# EAGLE design pump-board-1.0 (EAGLE 9.4.2)
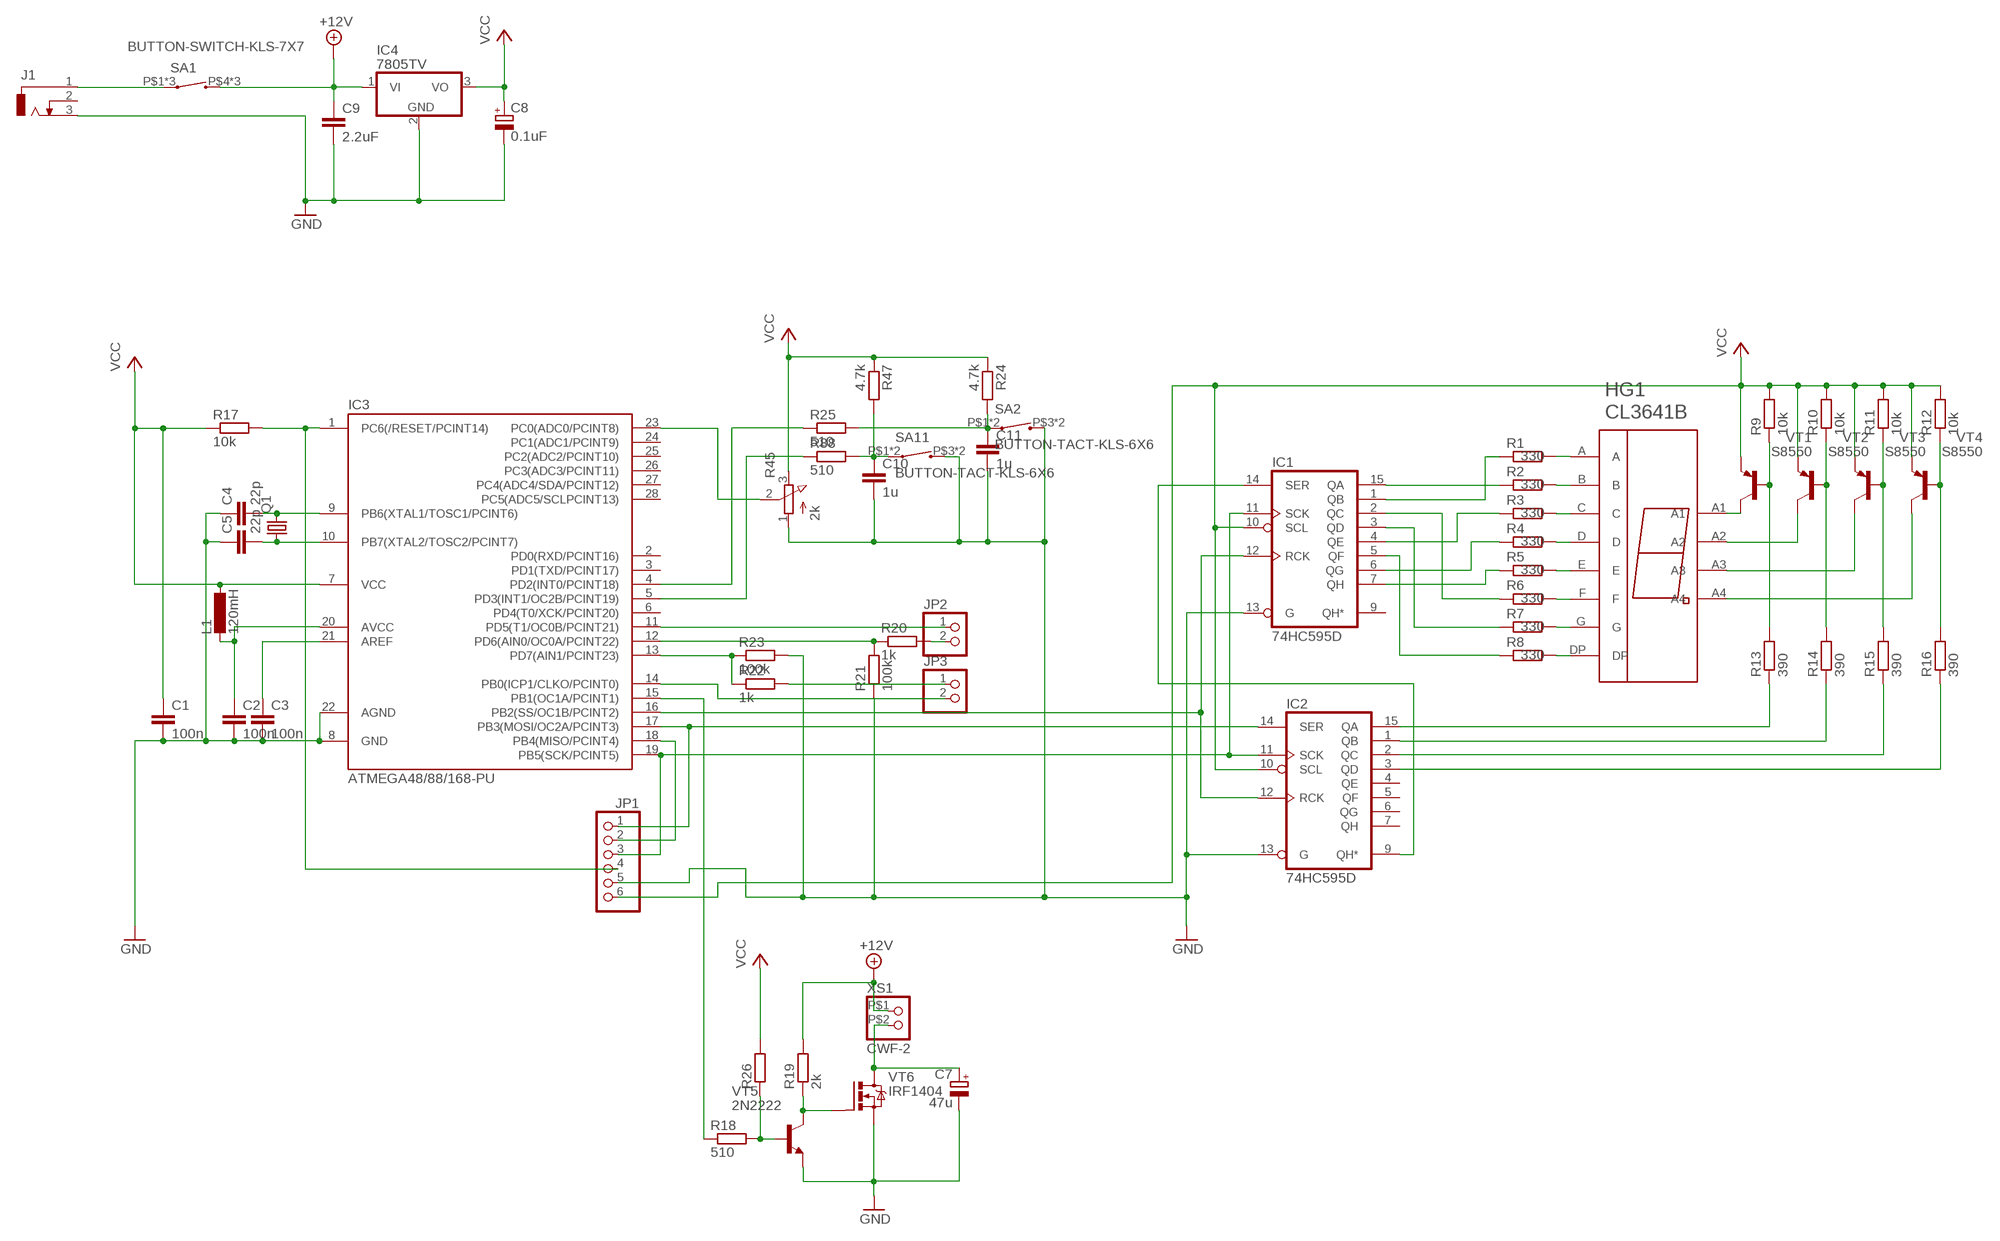
[diagram p0: schematic, sheet 1]

## Parts
C1  100n  C-EU025-025X050  [C025-025X050]
C2  100n  C-EUC1206  [C1206]
C3  100n  C-EUC1206  [C1206]
C4  22p  C-EUC1206  [C1206]
C5  22p  C-EUC1206  [C1206]
C7  47u  CPOL-EUE2.5-5  [E2,5-5]
C8  0.1uF  CPOL-EUE2.5-5  [E2,5-5]
C9  2.2uF  C-EU025-025X050  [C025-025X050]
C10  1u  C-EUC1206  [C1206]
C11  1u  C-EUC1206  [C1206]
HG1  CL3641B  [CL3641B]
IC1  74HC595D  [SO16]
IC2  74HC595D  [SO16]
IC3  ATMEGA48/88/168-PU  [DIL28-3]
IC4  7805TV  [TO220V]
J1  DCJ0303  [DCJ0303]
JP1  PINHD-1X6  [1X06]
JP2  PINHD-1X2  [1X02]
JP3  PINHD-1X2  [1X02]
L1  120mH  L-EU0207/10  [0207/10]
Q1  CRYSTALHC49S  [HC49/S]
R1  330  R-EU_R1206  [R1206]
R2  330  R-EU_R1206  [R1206]
R3  330  R-EU_R1206  [R1206]
R4  330  R-EU_R1206  [R1206]
R5  330  R-EU_R1206  [R1206]
R6  330  R-EU_R1206  [R1206]
R7  330  R-EU_R1206  [R1206]
R8  330  R-EU_R1206  [R1206]
R9  10k  R-EU_R1206  [R1206]
R10  10k  R-EU_R1206  [R1206]
R11  10k  R-EU_R1206  [R1206]
R12  10k  R-EU_R1206  [R1206]
R13  390  R-EU_R1206  [R1206]
R14  390  R-EU_R1206  [R1206]
R15  390  R-EU_R1206  [R1206]
R16  390  R-EU_R1206  [R1206]
R17  10k  R-EU_0207/10  [0207/10]
R18  510  R-EU_0207/10  [0207/10]
R19  2k  R-EU_R1206  [R1206]
R20  1k  R-EU_R1206  [R1206]
R21  100k  R-EU_R1206  [R1206]
R22  1k  R-EU_R1206  [R1206]
R23  100k  R-EU_R1206  [R1206]
R24  4.7k  R-EU_R1206  [R1206]
R25  510  R-EU_R1206  [R1206]
R26  R-EU_R1206  [R1206]
R45  2k  3RP/1610N  [3RP/1610N]
R47  4.7k  R-EU_R1206  [R1206]
R88  510  R-EU_R1206  [R1206]
SA1  BUTTON-SWITCH-KLS-7X7  [KSL7-7X7]
SA2  BUTTON-TACT-KLS-6X6  [KLS7-6X6]
SA11  BUTTON-TACT-KLS-6X6  [KLS7-6X6]
VT1  S8550  [TO92]
VT2  S8550  [TO92]
VT3  S8550  [TO92]
VT4  S8550  [TO92]
VT5  2N2222  [TO92]
VT6  IRF1404  [TO220-V]
XS1  CWF-2  [CWF-2]

## Nets
+12V: C9.1 IC4.1(VI) R19.2 SA1.P$4 SA1.P$5 SA1.P$6 XS1.P$1
ADC1: IC3.23(PC0(ADC0/PCINT8)) R45.2(S)
GND: C1.2 C2.2 C3.2 C4.1 C5.1 C7.- C8.- C9.2 C10.2 C11.2 IC1.13(G) IC2.13(G) IC3.8(GND) IC3.22(AGND) IC4.2(GND) J1.3 JP1.5 R21.1 R23.2 R45.1(A) SA2.P$3 SA2.P$4 SA11.P$3 SA11.P$4 VT5.3(E) VT6.S
MODE-CTRL-B: IC3.5(PD3(INT1/OC2B/PCINT19)) R88.1
N$1: HG1.A1 VT1.1(C)
N$2: HG1.A2 VT2.1(C)
N$3: HG1.A3 VT3.1(C)
N$4: HG1.A4 VT4.1(C)
N$5: R9.1 R13.2 VT1.2(B)
N$6: R10.1 R14.2 VT2.2(B)
N$7: R11.1 R15.2 VT3.2(B)
N$8: R12.1 R16.2 VT4.2(B)
N$9: HG1.DP R8.2
N$10: HG1.G R7.2
N$11: HG1.F R6.2
N$12: IC2.15(QA) R13.1
N$13: HG1.E R5.2
N$14: HG1.D R4.2
N$15: HG1.C R3.2
N$16: HG1.B R2.2
N$17: HG1.A R1.2
N$18: IC2.1(QB) R14.1
N$19: IC2.2(QC) R15.1
N$20: IC2.3(QD) R16.1
N$21: IC1.15(QA) R2.1
N$22: IC1.1(QB) R1.1
N$23: IC1.2(QC) R6.1
N$24: IC1.4(QE) R3.1
N$25: IC1.7(QH) R5.1
N$26: IC1.5(QF) R8.1
N$27: IC1.3(QD) R7.1
N$28: IC1.6(QG) R4.1
N$29: IC1.14(SER) IC2.9(QH*)
N$30: IC3.18(PB4(MISO/PCINT4)) JP1.2
N$31: IC1.12(RCK) IC2.12(RCK) IC3.16(PB2(SS/OC1B/PCINT2))
N$32: C3.1 IC3.21(AREF)
N$33: IC1.11(SCK) IC2.11(SCK) IC3.19(PB5(SCK/PCINT5)) JP1.3
N$35: IC3.1(PC6(/RESET/PCINT14)) JP1.4 R17.2
N$36: C2.1 IC3.20(AVCC) L1.2
N$37: C5.2 IC3.10(PB7(XTAL2/TOSC2/PCINT7)) Q1.1
N$38: C4.2 IC3.9(PB6(XTAL1/TOSC1/PCINT6)) Q1.2
N$39: R19.1 VT5.1(C) VT6.G
N$40: R18.2 R26.1 VT5.2(B)
N$41: C7.+ VT6.D XS1.P$2
N$42: IC3.15(PB1(OC1A/PCINT1)) R18.1
N$43: IC3.12(PD6(AIN0/OC0A/PCINT22)) R20.1 R21.2
N$44: IC3.11(PD5(T1/OC0B/PCINT21)) JP2.1
N$45: IC3.14(PB0(ICP1/CLKO/PCINT0)) JP3.2
N$46: IC3.13(PD7(AIN1/PCINT23)) R22.1 R23.1
N$47: JP3.1 R22.2
N$48: JP2.2 R20.2
N$49: C10.1 R47.2 R88.2 SA11.P$1 SA11.P$2
N$50: IC3.4(PD2(INT0/PCINT18)) R25.1
N$51: C11.1 R24.2 R25.2 SA2.P$1 SA2.P$2
N$52: IC2.14(SER) IC3.17(PB3(MOSI/OC2A/PCINT3)) JP1.1
N$62: J1.1 SA1.P$1 SA1.P$2 SA1.P$3
VCC: C1.1 C8.+ IC1.10(SCL) IC2.10(SCL) IC3.7(VCC) IC4.3(VO) JP1.6 L1.1 R9.2 R10.2 R11.2 R12.2 R17.1 R24.1 R26.2 R45.3(E) R47.1 VT1.3(E) VT2.3(E) VT3.3(E) VT4.3(E)
Unconnected: IC1.9(QH*) IC2.4(QE) IC2.5(QF) IC2.6(QG) IC2.7(QH) IC3.2(PD0(RXD/PCINT16)) IC3.3(PD1(TXD/PCINT17)) IC3.6(PD4(T0/XCK/PCINT20)) IC3.24(PC1(ADC1/PCINT9)) IC3.25(PC2(ADC2/PCINT10)) IC3.26(PC3(ADC3/PCINT11)) IC3.27(PC4(ADC4/SDA/PCINT12)) IC3.28(PC5(ADC5/SCLPCINT13)) J1.2

## Power pins joined to a net without a drawn wire
GND: IC1.8(GND) IC2.8(GND)
VCC: IC1.16(VCC) IC2.16(VCC)

## Library data of the parts
C1-C5 C9-C11 = rcl:C-EU: CAPACITOR, European symbol; SPICEPREFIX: C
C7 C8 = rcl:CPOL-EU: POLARIZED CAPACITOR, European symbol; SPICEPREFIX: C
HG1 = dragberry:CL3641B
IC1 IC2 = 74xx-eu:74*595: 8-bit SHIFT REGISTER, output latch
IC3 = atmega8:ATMEGA48/88/168-PU
IC4 = linear:78*: Positive VOLTAGE REGULATOR Source: http://cache.national.com/ds/LM/LM78L05.pdf http://www.fairchildsemi.com/ds/LM/LM7805.pdf
J1 = con-jack:DCJ0303: DC POWER JACK Source: DCJ0303.pdf; OC_FARNELL: unknown; OC_NEWARK: unknown
JP1 = pinhead:PINHD-1X6: PIN HEADER
JP2 JP3 = pinhead:PINHD-1X2: PIN HEADER
L1 = rcl:L-EU: INDUCTOR, European symbol; SPICEPREFIX: L
Q1 = crystal:CRYSTAL: CRYSTAL; OC_FARNELL: 1667008; OC_NEWARK: unknown
R1-R26 R47 R88 = rcl:R-EU_: RESISTOR, European symbol; SPICEPREFIX: R
R45 = pot:3RP/1610N: 16mm Potentiometer one level Source: http://www.alphapotentiometers.net/html/16mm_pot_2.html
SA1 SA2 SA11 = dragberry:BUTTON
VT1-VT4 = dragberry:S8550
VT5 = dragberry:2N2222
VT6 = dragberry:IRF1404
XS1 = dragberry:CWF-2

## Board
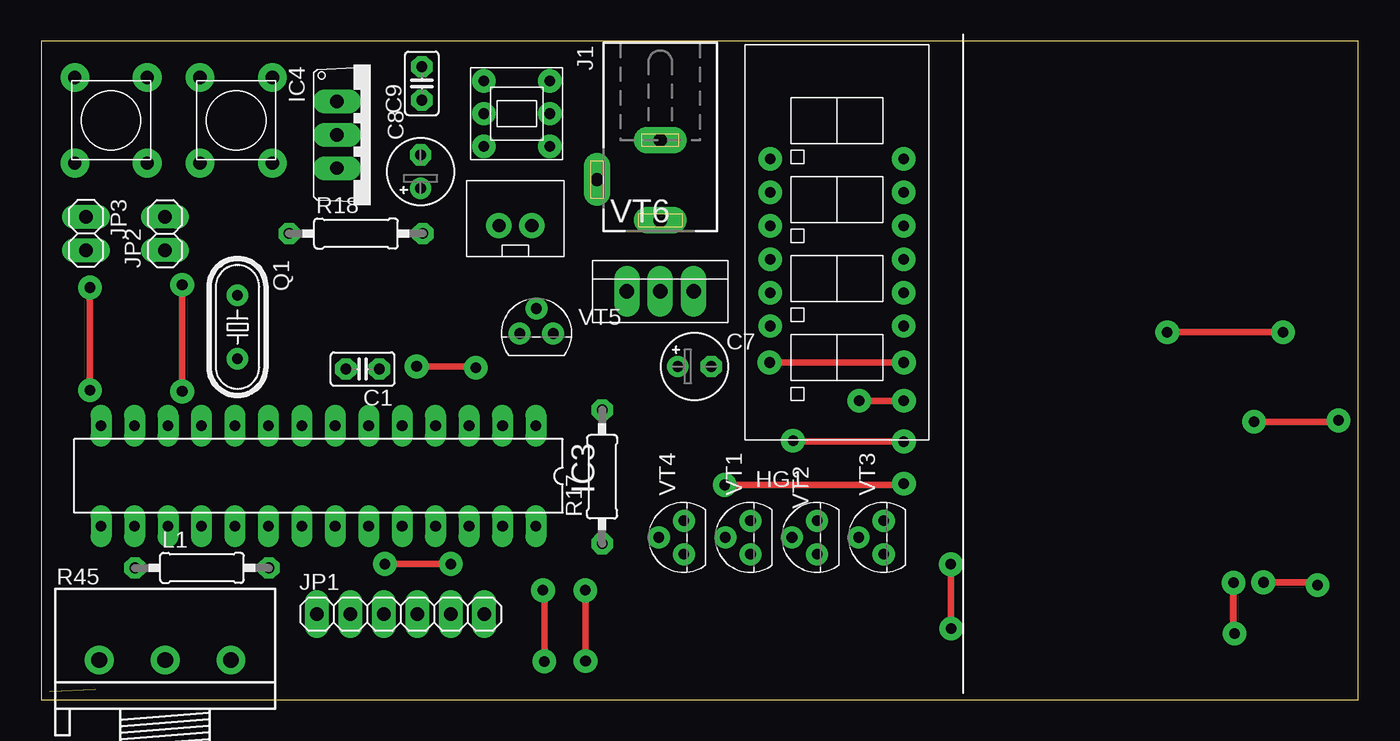
[diagram p1: board, top side]
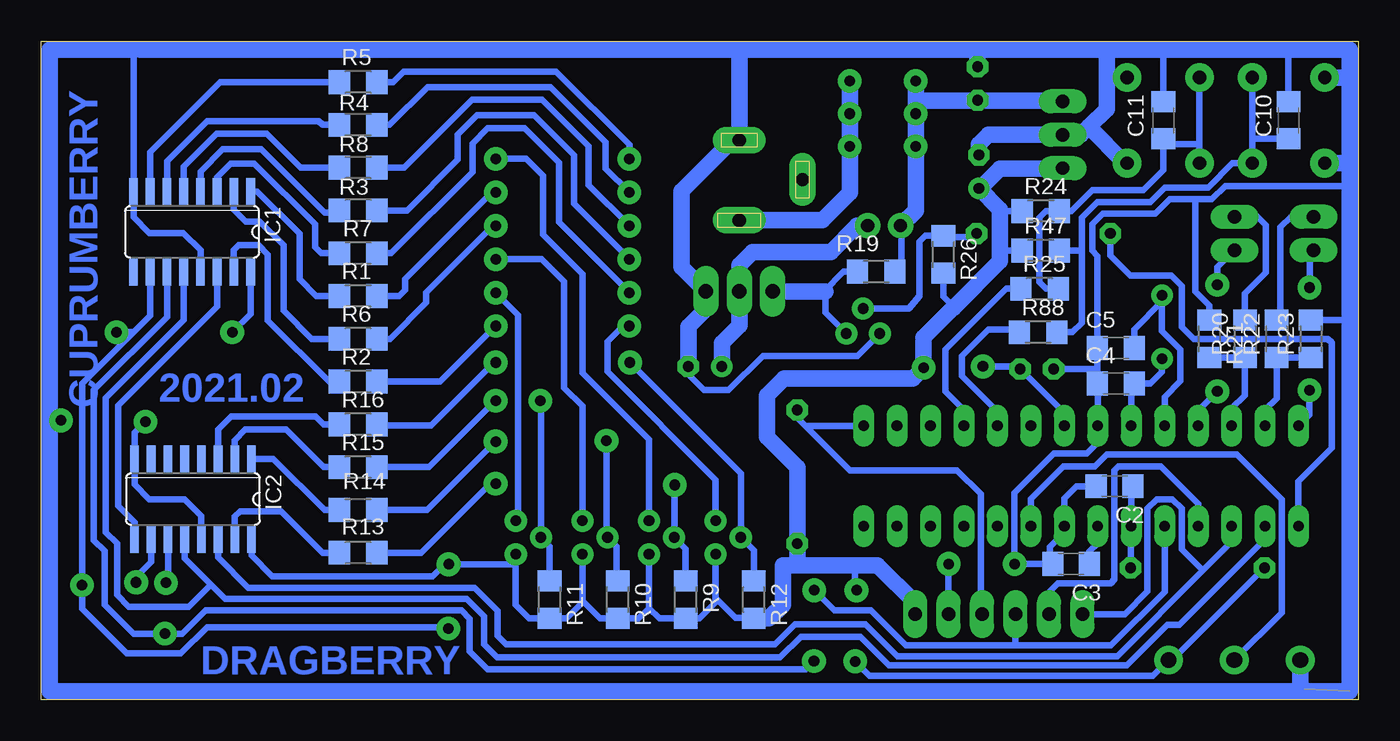
[diagram p2: board, bottom side, seen from below]

Size 100 x 50 mm. Coordinates in mm from the lower left corner, seen from the top.
Outline: 0,0 100,0 100,50 0,50 0,0
Copper layers (1*16): Top 0.035mm / dielectric 1.5mm / Bottom 0.035mm
Design rules "default *": minimum track width 6mil, minimum drill 0.35mm, track to track 6mil, track to pad 6mil, pad to pad 6mil, via to via 6mil, smd to smd 6mil, copper to edge 6mil, drill to drill 6mil, minimum pad ring 0.4mm, minimum via ring 8mil, stop-mask expansion 4mil, vias tented up to drill 0mil, thermal gap 10mil

### Footprints (pad centres in the part's own frame; a part is rotated, then mirrored left to right if it is on the bottom)
C025-025X050 = drill 0.813 octagon: 1 -1.27,0; 2 1.27,0
C1206 = smd 1.6 x 1.8: 1 -1.4,0; 2 1.4,0
E2,5-5 = drill 0.813 pad 1.6: + -1.27,0 | drill 0.813 pad 1.6 octagon: - 1.27,0
CL3641B = drill 0.8 pad 1.778: A -3.81,5.08; A1 -6.35,5.08; A2 1.27,5.08; A3 3.81,5.08; A4 6.35,-5.08; B 6.35,5.08; C 1.27,-5.08; D -3.81,-5.08; DP -1.27,-5.08; E -6.35,-5.08; F -1.27,5.08; G 3.81,-5.08
SO16 = smd 0.66 x 2.032: 1 -4.445,-3.073; 2 -3.175,-3.073; 3 -1.905,-3.073; 4 -0.635,-3.073; 5 0.635,-3.073; 6 1.905,-3.073; 7 3.175,-3.073; 8 4.445,-3.073; 9 4.445,3.073; 10 3.175,3.073; 11 1.905,3.073; 12 0.635,3.073; 13 -0.635,3.073; 14 -1.905,3.073; 15 -3.175,3.073; 16 -4.445,3.073
DIL28-3 = drill 0.813 long: 1 -16.51,-3.81; 2 -13.97,-3.81; 3 -11.43,-3.81; 4 -8.89,-3.81; 5 -6.35,-3.81; 6 -3.81,-3.81; 7 -1.27,-3.81; 8 1.27,-3.81; 9 3.81,-3.81; 10 6.35,-3.81; 11 8.89,-3.81; 12 11.43,-3.81; 13 13.97,-3.81; 14 16.51,-3.81; 15 16.51,3.81; 16 13.97,3.81; 17 11.43,3.81; 18 8.89,3.81; 19 6.35,3.81; 20 3.81,3.81; 21 1.27,3.81; 22 -1.27,3.81; 23 -3.81,3.81; 24 -6.35,3.81; 25 -8.89,3.81; 26 -11.43,3.81; 27 -13.97,3.81; 28 -16.51,3.81
TO220V = drill 1.016 long: 1 -2.54,-2.54; 2 0,-2.54; 3 2.54,-2.54
DCJ0303 = drill 1 pad 2 long: 1 0,3.1; 2 4.8,0; 3 0,-3
1X06 = drill 1.016 long: 1 -6.35,0; 2 -3.81,0; 3 -1.27,0; 4 1.27,0; 5 3.81,0; 6 6.35,0
1X02 = drill 1.016 long: 1 -1.27,0; 2 1.27,0
0207/10 = drill 0.813 octagon: 1 -5.08,0; 2 5.08,0
HC49/S = drill 0.813: 1 -2.413,0; 2 2.413,0
R1206 = smd 1.6 x 1.803: 1 -1.422,0; 2 1.422,0
3RP/1610N = drill 1.2 pad 2.184: 1 -5,0; 2 0,0; 3 5,0
KSL7-7X7 = drill 0.8 pad 1.778: P$1 -2.5,2.5; P$2 0,2.5; P$3 2.5,2.5; P$4 2.5,-2.5; P$5 0,-2.5; P$6 -2.5,-2.5
KLS7-6X6 = drill 1 pad 2.184: P$1 -3.25,2.75; P$2 3.25,2.75; P$3 -3.25,-2.75; P$4 3.25,-2.75
TO92 = drill 0.813 pad 1.676: 1 1.27,0; 2 0,1.905; 3 -1.27,0
TO220-V = drill 1.118 long: D 0,0; G -2.54,0; S 2.54,0
CWF-2 = drill 1 pad 1.93: P$1 -1.25,0; P$2 1.25,0

### Placement (x,y rotation side)
C1  24.4,25.1 180 top
C2  18.5,16.2 180 bottom
C3  21.8,10.3 180 bottom
C4  18.4,24 0 bottom
C5  18.4,26.7 0 bottom
C7  49.6,25.3 0 top
C8  28.8,40.1 90 top
C9  28.9,46.8 90 top
C10  5.3,44 90 bottom
C11  14.8,44 90 bottom
HG1  60.42,34.72 270 top
IC1  88.55,35.52 180 bottom
IC2  88.48,15.22 180 bottom
IC3  21.05,16.98 180 top
IC4  25,42.9 270 top
J1  47,39.5 180 top
JP1  27.29,6.48 0 top
JP2  9.4,35.4 90 top
JP3  3.4,35.4 270 top
L1  12.2,10 0 top
Q1  14.9,28.3 270 top
R1  75.94,30.65 0 bottom
R2  75.94,24.15 0 bottom
R3  75.94,37.15 0 bottom
R4  75.94,43.65 0 bottom
R5  75.94,46.9 0 bottom
R6  75.94,27.4 0 bottom
R7  75.94,33.9 0 bottom
R8  75.94,40.4 0 bottom
R9  51.07,7.58 270 bottom
R10  56.23,7.58 270 bottom
R11  61.4,7.58 270 bottom
R12  45.9,7.58 270 bottom
R13  75.94,11.15 0 bottom
R14  75.94,14.4 0 bottom
R15  75.94,17.65 0 bottom
R16  75.94,20.9 0 bottom
R17  42.59,16.92 90 top
R18  23.9,35.4 0 top
R19  36.6,32.5 0 bottom
R20  8.6,27.4 90 bottom
R21  11.3,27.4 270 bottom
R22  6.2,27.4 90 bottom
R23  3.6,27.4 90 bottom
R24  24.1,37.1 0 bottom
R25  24.2,31.2 0 bottom
R26  31.5,33.8 270 bottom
R45  9.4,3 0 top
R47  24.1,34.1 0 bottom
R88  24.3,27.9 0 bottom
SA1  36.1,44.5 270 top
SA2  14.8,44 90 top
SA11  5.3,44 270 top
VT1  53.85,12.31 90 top
VT2  58.91,12.31 90 top
VT3  63.97,12.31 90 top
VT4  48.79,12.31 90 top
VT5  37.6,27.8 0 top
VT6  47,31 0 top
XS1  36,36 0 top

### Tracks (layer width: path | path; a pad name or v marks a point on that pad's centre or on a via)
+12V
  Bottom 0.508: 34.07,36.68 XS1.P$1 | R19.2 34.68,33 34.68,36.07
  Bottom 1.27: IC4.1 24.1,45.5 28.93,45.5 | C9.1 28.93,45.5 | XS1.P$1 34.68,36.07 33.6,37.15 SA1.P$4 SA1.P$5 SA1.P$6 33.6,45.5 28.93,45.5
ADC1
  Bottom 0.508: R45.2 5.8,6.6 5.8,15.2 9.2,18.6 19.1,18.6 20,17.7 22.4,17.7 24.86,15.24 IC3.23
GND  (via drill 0.8 pad 1.8)  (1 unrouted)
  Top 0.508: v92.1,21.1 98.4,21.1 v98.5,21.2 | v26.1,10.3 v31.1,10.3
  Bottom 0.508: 93,49.37 IC1.8 93,36.65 91.8,35.45 89.22,35.45 87.92,34.15 IC1.13 | IC2.13 87.84,13.95 89.1,15.2 91.8,15.2 92.92,16.32 IC2.8 92.92,20.27 v92.1,21.1 | v98.5,21.2 99.36,21.2 | 19.8,25.1 C5.1 19.8,33.7 20.2,34.1 20.2,36.1 19.4,36.9 15.4,36.9 14.3,38 12.37,38 | 19.8,25.1 C4.1 19.78,23.98 IC3.8 19.78,19.52 20.6,18.7 23.1,18.7 26.1,15.7 v26.1,10.3 C3.2 23.39,10.49 23.39,11.6 22.32,12.67 IC3.22 22.32,15.28 21.4,16.2 C2.2 | 49.54,29.94 VT6.S | C11.2 14.8,49.16 15,49.37 | C10.2 5.3,49.37 | 0.64,39 10.1,39 11.1,38 12.37,38 | VT5.3 38.03,26.1 45.2,26.1 47.8,23.5 49.67,23.5 50.87,24.7 C7.- | C1.2 19.8,25.1 | R21.1 11.3,29.92 12.37,30.99 12.37,38 | R23.2 0.71,28.82 0.64,28.9 | v31.1,10.3 JP1.5
  Bottom 1.27: 0.64,47.25 0.64,49.37 5.3,49.37 15,49.37 19.3,49.37 | 93,49.37 99.36,49.37 99.36,21.2 99.36,0.64 0.64,0.64 0.64,28.9 0.64,39 0.64,40.75 | 92.5,49.37 47.2,49.37 | 47.2,49.37 28.9,49.37 | 28.9,49.37 19.3,49.37 | 47.2,49.37 47,49.16 J1.3 47.5,42.5 51.4,38.6 51.4,32.86 VT6.S 49.54,29.66 50.87,28.33 C7.- | 20.46,43.5 21.06,42.9 IC4.2 28.07,42.9 28.8,42.17 C8.- | 20.46,43.5 19.1,44.86 19.1,47.25 | 19.1,47.25 19.1,49.16 19.3,49.37 | C9.2 28.9,49.37 | 0.64,40.75 SA11.P$4 | SA2.P$4 19.1,47.25 | 20.46,43.5 17.71,40.75 SA2.P$3 | SA11.P$3 0.64,47.25 | 0.64,47.25 0.64,40.75 | R45.1 4.4,0.79 4.1,0.79
MODE-CTRL-B
  Bottom 0.508: IC3.5 27.4,21.89 30.1,24.59 30.1,26.1 28.1,28.1 25.92,28.1 R88.1
N$1
  Bottom 0.508: HG1.A1 63.17,41.07 61.9,39.8 61.9,35.3 58.9,32.3 58.9,24.8 53.85,19.75 VT1.1
N$2
  Bottom 0.508: HG1.A2 62,33.45 60.3,31.75 60.3,23.67 58.91,22.28 VT2.1
N$3
  Bottom 0.508: HG1.A3 63.8,29.21 63.8,13.65 63.87,13.58 VT3.1
N$4
  Bottom 0.508: HG1.A4 55.84,28.37 57,27.21 57,24.9 48.79,16.69 VT4.1
N$5  (via drill 0.8 pad 1.8)
  Top 0.508: v65.5,16.4 65.4,16.3 v51.9,16.3
  Bottom 0.508: R9.1 51.07,11.43 VT1.2 51.9,12.36 v51.9,16.3 | v65.5,16.4 65.9,16.4 71.15,11.15 R13.2
N$6  (via drill 0.8 pad 1.8)
  Top 0.508: v57.08,19.66 57.08,19.6 v65.5,19.6
  Bottom 0.508: R10.1 56.31,9.08 56.31,11.62 VT2.2 57.08,12.38 v57.08,19.66 | R14.2 70.7,14.4 v65.5,19.6
N$7  (via drill 0.8 pad 1.8)
  Top 0.508: v65.5,22.7 v62.11,22.7
  Bottom 0.508: R11.1 61.4,11.64 VT3.2 62.06,22.55 62.11,22.6 v62.11,22.7 | R15.2 70.55,17.65 v65.5,22.7
N$8  (via drill 0.8 pad 1.8)
  Top 0.508: v65.5,25.6 v55.3,25.6
  Bottom 0.508: R12.1 45.9,11.32 VT4.2 46.88,17.18 v55.3,25.6 | v65.5,25.6 65.6,25.6 70.4,20.8 74.42,20.8 R16.2
N$9
  Bottom 0.508: HG1.DP 58.44,39.09 58.44,42.04 61.96,45.56 67.28,45.56 72.44,40.4 R8.2
N$10
  Bottom 0.508: R7.2 73.42,33.9 67.26,40.06 67.26,42.24 66.11,43.39 63.29,43.39 60.7,40.8 60.7,36.27 HG1.G
N$11
  Bottom 0.508: HG1.F 65.71,35.99 70.78,30.92 70.78,30.15 73.53,27.4 R6.2
N$12
  Bottom 0.508: R13.1 78.65,11.15 81.8,14.3 84.9,14.3 85.31,13.89 IC2.15
N$13
  Bottom 0.508: HG1.E 55.34,42.14 60.9,47.7 72.48,47.7 73.28,46.9 R5.2
N$14
  Bottom 0.508: HG1.D 57.14,40.33 57.14,42.34 61.33,46.53 70.68,46.53 73.56,43.65 R4.2
N$15
  Bottom 0.508: HG1.C 59.54,37.65 59.54,41.34 62.6,44.4 66.9,44.4 68.38,42.92 68.38,40.99 72.22,37.15 R3.2
N$16
  Bottom 0.508: R2.2 69.72,24.15 HG1.B
N$17
  Bottom 0.508: HG1.A 65.77,38.53 72.38,31.92 72.38,31.12 72.85,30.65 R1.2
N$18
  Bottom 0.508: R14.1 78.5,14.4 82.39,18.29 IC2.1
N$19
  Bottom 0.508: R15.1 78.56,17.65 81.41,20.5 84.5,20.5 85.31,19.7 IC2.2
N$20
  Bottom 0.508: IC2.3 86.58,20.52 85.6,21.5 79.16,21.5 78.56,20.9 R16.1
N$21
  Bottom 0.508: R2.1 78.15,24.15 82.8,28.8 82.8,33.8 83.5,34.5 85,34.5 85.38,34.12 IC1.15
N$22
  Bottom 0.508: R1.1 79.13,30.65 80.4,31.92 80.4,35.4 83.59,38.59 IC1.1
N$23
  Bottom 0.508: IC1.2 85.38,37.2 84.47,36.3 83.4,36.3 81.6,34.5 81.6,29.53 79.47,27.4 R6.1
N$24
  Bottom 0.508: IC1.4 87.92,40.1 86.22,41.8 83.3,41.8 78.5,37 77.51,37 R3.1
N$25
  Bottom 0.508: R5.1 86.4,46.9 91.72,41.58 IC1.7
N$26
  Bottom 0.508: IC1.5 89.19,40.49 86.68,43 82.9,43 80.3,40.4 R8.1
N$27
  Bottom 0.508: IC1.3 86.64,39.69 85.64,40.7 83.82,40.7 79.22,36.1 79.22,34.36 78.76,33.9 R7.1
N$28
  Bottom 0.508: IC1.6 90.45,40.89 87.42,43.93 78.92,43.93 78.64,43.65 R4.1
N$29
  Bottom 0.508: IC2.9 92.92,13.47 94.16,14.71 94.16,22.34 86.64,29.86 IC1.14
N$30
  Bottom 0.508: JP1.2 23.48,8.15 22.82,8.81 18.8,8.81 18.5,9.11 18.5,17.4 18.2,17.7 15,17.7 12.16,14.86 IC3.18
N$31
  Bottom 0.508: IC1.12 89.19,28.82 95.1,22.9 95.1,12.7 94.25,11.85 94.25,7.95 93.35,7.05 88.8,7.05 87.15,8.7 87.15,8.75 | 87.15,8.75 89.11,10.71 IC2.12 | 87.15,8.75 86.05,7.65 67.7,7.65 66.38,6.33 66.38,4.17 65.4,3.2 43.9,3.2 42.33,4.77 37.8,4.77 35.63,2.6 17.57,2.6 14.49,5.67 13.57,5.67 7.08,12.17 IC3.16
N$32
  Bottom 0.508: IC3.21 19.78,11.87 20.4,11.25 C3.1
N$33  (via drill 0.8 pad 1.8)
  Top 0.508: v90.53,8.87 90.53,5.07 v90.6,5 | v41.3,8.3 41.33,8.27 v41.33,2.93
  Bottom 0.508: IC1.11 90.45,29.05 96,23.5 96,12.1 95.2,11.3 95.2,7.2 92.98,4.98 90.62,4.98 v90.6,5 89.3,5 87.52,6.78 68.1,6.78 67.46,6.14 67.46,3.66 66.1,2.3 41.95,2.3 v41.33,2.93 | IC2.11 90.35,12.11 90.35,9.05 v90.53,8.87 | v41.3,8.3 39.77,6.77 37,6.77 34.33,4.1 26.2,4.1 | IC3.19 14.7,8.17 18.77,4.1 26.2,4.1 | 26.13,6.77 26.13,6.59 JP1.3 26.02,4.28 26.2,4.1
N$35
  Bottom 0.508: IC3.1 41.78,20.79 41.78,20.59 | R17.2 42.59,21.4 41.78,20.59 | 41.78,20.59 38.59,17.4 30.46,17.4 28.66,15.6 28.66,6.58 JP1.4
N$36
  Bottom 0.508: C2.1 17.24,16.06 IC3.20 17.28,13.13 L1.2
N$37
  Bottom 0.508: IC3.10 14.7,22.99 13.5,24.19 13.5,26.6 14.9,28 Q1.1 14.9,30.21 17,28.11 C5.2
N$38
  Bottom 0.508: IC3.9 17.24,23.76 C4.2 15.79,24 14.9,24.89 Q1.2
N$39
  Bottom 0.508: 40.57,31 39.07,32.5 R19.1 | 40.47,31 40.47,29.4 VT5.1
  Bottom 1.27: VT6.G 40.57,31 40.47,31
N$40
  Bottom 0.508: VT5.2 34.11,29.7 33.32,30.66 33.32,34.78 32.88,35.22 R26.1 31.5,35.14 28.98,35.14 R18.2
N$41
  Bottom 1.27: XS1.P$2 38.05,36 40.05,34 46,34 47,33 VT6.D 47,28.4 48.33,27.07 C7.+
N$42
  Bottom 0.508: IC3.15 4.54,16.56 2,19.1 2,27.1 2.3,27.4 12.5,27.4 13.4,28.3 13.4,31.4 14.2,32.2 17.3,32.2 18.82,33.72 R18.1
N$43
  Bottom 0.508: IC3.12 9.62,22.09 8.6,23.11 R20.1 R21.2
N$44  (via drill 0.8 pad 1.8)
  Top 0.508: v10.7,31.5 v10.7,23.4
  Bottom 0.508: JP2.1 10.7,32.83 v10.7,31.5 | IC3.11 12.16,21.94 v10.7,23.4
N$45  (via drill 0.8 pad 1.8)
  Top 0.508: v3.7,23.5 v3.69,23.51 v3.69,31.29
  Bottom 0.508: IC3.14 3.7,21.63 v3.7,23.5 | v3.69,31.29 3.69,33.84 JP3.2
N$46
  Bottom 0.508: IC3.13 7.08,21.99 6.2,22.87 6.2,25.9 | R22.1 6.2,25.9 | R23.1 6.12,25.98 6.2,25.9
N$47
  Bottom 0.508: R22.2 5.9,29.12 5.9,35.87 5.1,36.67 JP3.1
N$48
  Bottom 0.508: JP2.2 7.65,36.67 7,36.02 7,32.42 8.6,30.82 R20.2
N$49
  Bottom 0.508: SA11.P$1 8.05,42.6 | 8.05,42.6 SA11.P$2 9.55,40.75 11.4,38.9 14.7,38.9 15.8,37.8 19.8,37.8 21,36.6 21,34.1 | C10.1 8.05,42.6 | 21,34.1 R47.2 | R88.2 21.7,27.9 21,28.6 21,34.1
N$50
  Bottom 0.508: R25.1 26.72,31.2 31.34,26.58 31.34,23.39 29.94,21.99 IC3.4
N$51
  Bottom 0.508: SA2.P$2 12.05,42.2 | 12.05,42.2 SA2.P$1 | 12.05,42.2 14.4,42.2 C11.1 14.8,40.2 16.3,38.7 20.18,38.7 21.78,37.1 R24.2 23.7,37.1 24.2,36.6 24.2,31.7 23.7,31.2 R25.2
N$52
  Bottom 0.508: IC2.14 86.58,10.8 84.28,8.5 67.1,8.5 65.35,6.75 65.35,4.85 64.7,4.2 44.3,4.2 42.78,5.72 37.4,5.72 34.98,3.3 18.29,3.3 11.79,9.79 | IC3.17 9.62,11.97 11.79,9.79 | JP1.1 17.72,6.48 16,8.2 16,14.5 15.3,15.2 14.1,15.2 13.4,14.5 13.4,11.4 11.79,9.79
N$62
  Bottom 1.27: 47.04,36.4 J1.1 40.7,36.4 38.6,38.5 SA1.P$3 SA1.P$2 SA1.P$1
VCC  (via drill 0.8 pad 1.8)
  Top 0.508: v94.3,27.9 v85.5,27.9 | v69.07,10.27 69.07,5.43 v69.1,5.4 | v96.9,8.7 96.9,8.9 v92.8,8.9 | v33,25.2 32.9,25.3 v28.5,25.3 | v38.1,8.3 38.2,8.2 v38.2,2.9
  Bottom 0.508: IC1.10 91.72,29.18 93,27.9 | IC1.16 84.11,29.3 v85.5,27.9 | v94.3,27.9 93,27.9 | 93,27.9 96.9,24 v96.9,8.7 96.9,6.9 93.5,3.5 89.4,3.5 87.4,5.5 69.2,5.5 v69.1,5.4 | VT4.3 48.79,7.7 | 48.79,7.7 48.79,7.4 50.03,6.16 R9.2 53.07,6.16 53.85,6.94 | VT1.3 53.85,6.94 | R12.2 45.96,6.22 47.3,6.22 48.78,7.7 48.79,7.7 | 53.85,6.94 54.63,6.16 R10.2 57.56,6.16 58.91,7.51 | VT2.3 58.91,7.51 | 58.91,7.51 58.91,7.37 60.12,6.16 R11.2 62.96,6.16 64,7.2 63.97,7.23 63.97,10.27 | IC2.16 84.03,10.95 82.46,9.37 70.27,9.37 69.37,10.27 v69.07,10.27 63.97,10.27 | 63.97,10.27 VT3.3 | IC2.10 91.66,10.45 92.75,9.35 92.75,8.9 v92.8,8.9 | R47.1 27.2,34.1 | R24.1 26.7,37.1 27.2,36.6 | 33,27.2 33,27.5 | IC3.7 22.32,21.75 C1.1 25.87,25.3 v28.5,25.3 | v38.2,2.9 37.1,1.8 15.6,1.8 R45.3 14.12,3 L1.1 | v38.1,8.3 38.2,8.4 38.2,10.2 | 30.7,29.8 31.5,30.6 R26.2
  Bottom 1.27: 22.52,40.3 IC4.3 22.49,40.33 27.2,40.33 28.7,38.83 C8.+ 27.2,37.23 27.2,36.6 27.2,34.1 27.2,33.3 30.75,29.75 | R12.2 44.74,6.16 43.69,7.21 43.69,10.2 42.59,10.2 | 42.59,10.2 R17.1 42.59,17.64 44.89,19.94 44.89,23.1 43.59,24.4 33.8,24.4 v33,25.2 33,27.2 | 42.59,10.2 38.2,10.2 36.5,10.2 33.64,7.34 JP1.6 | 33,27.5 30.7,29.8

### Text on the board
Bottom: CUPRUMBERRY | 2021.02 | DRAGBERRY